# Altium schematic sheet Telemetria_Comunicação.SchDoc
size A4; SheetNumber: 3; SheetTotal: 4
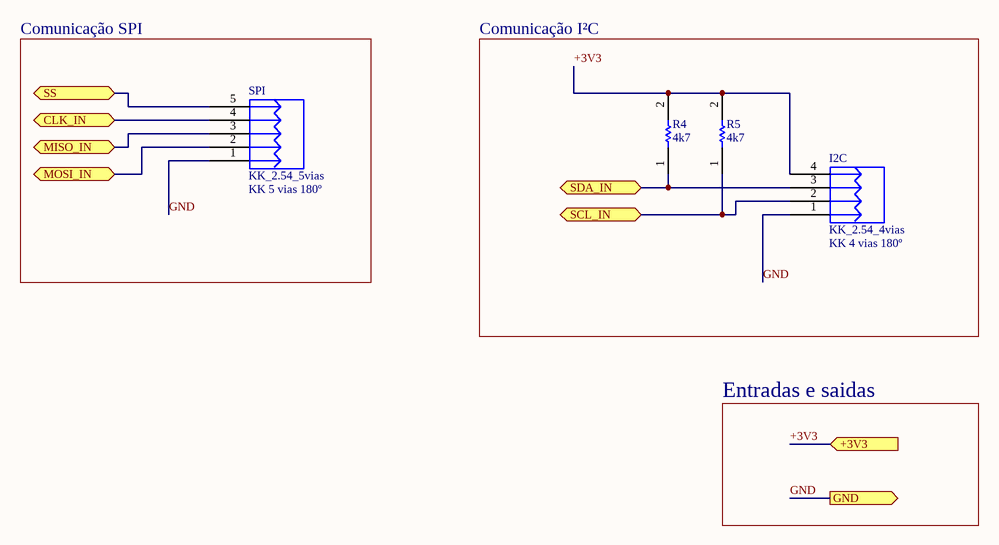
[diagram p0: Telemetria_Comunicação.SchDoc]

## Parts
I2C  KK_2.54_4vias  Valor: KK 4 vias 180º  [KK_4vias_180°]
R4  4k7  [RESC3216X60N]
R5  4k7  [RESC3216X60N]
SPI  KK_2.54_5vias  Valor: KK 5 vias 180º  [KK_5vias_180°]

## Blocks framed on the sheet
Comunicação SPI: SPI
Comunicação I²C: I2C R4 R5

## Ports
+3V3 (in), CLK_IN (bidir), GND (out), MISO_IN (bidir), MOSI_IN (bidir), SCL_IN (bidir), SDA_IN (bidir), SS (bidir)

## Nets
+3V3: I2C.4 R4.2 R5.2 ; port +3V3
CLK_IN: SPI.4 ; port CLK_IN
GND: I2C.1 SPI.1 ; port GND
MISO_IN: SPI.3 ; port MISO_IN
MOSI_IN: SPI.2 ; port MOSI_IN
SCL_IN: I2C.2 R5.1 ; port SCL_IN
SDA_IN: I2C.3 R4.1 ; port SDA_IN
SS: SPI.5 ; port SS

## Notes on the sheet
- Entradas e saidas

## Library data of the parts
I2C = KK_2.54_4vias: Conector KK 2.54mm 4 vias; Descrição: Conector KK 3 vias com passo 2.54mm; Encapsulamento: PTH - 180º; Modelo: 3 vias - 180º; Marca: *; Observação: *
R4 R5 = Resistor 1206: Resistor; Manufacturer_Name: Vishay; Manufacturer_Part_Number: CRCW12064K70FKEA; Datasheet Link: http://docs-emea.rs-online.com/webdocs/13ec/0900766b813ecc08.pdf; Height: 0.6mm; Mouser Part Number: 71-CRCW1206-4.7K-E3; Mouser Price/Stock: https://www.mouser.co.uk/ProductDetail/Vishay-Dale/CRCW12064K70FKEA?qs=1vm4qhDHCvlKJmatsKzyFQ%3D%3D; Arrow Part Number: CRCW12064K70FKEA; Arrow Price/Stock: https://www.arrow.com/en/products/crcw12064k70fkea/vishay
SPI = KK_2.54_5vias: Conector KK 2.54mm 5 vias; Descrição: Conector KK 3 vias com passo 2.54mm; Encapsulamento: PTH - 180º; Modelo: 3 vias - 180º; Marca: *; Observação: *